# EAGLE schematic teensyMotors02_up_LED (EAGLE 9.1.3)

## Sheet 1 of 2
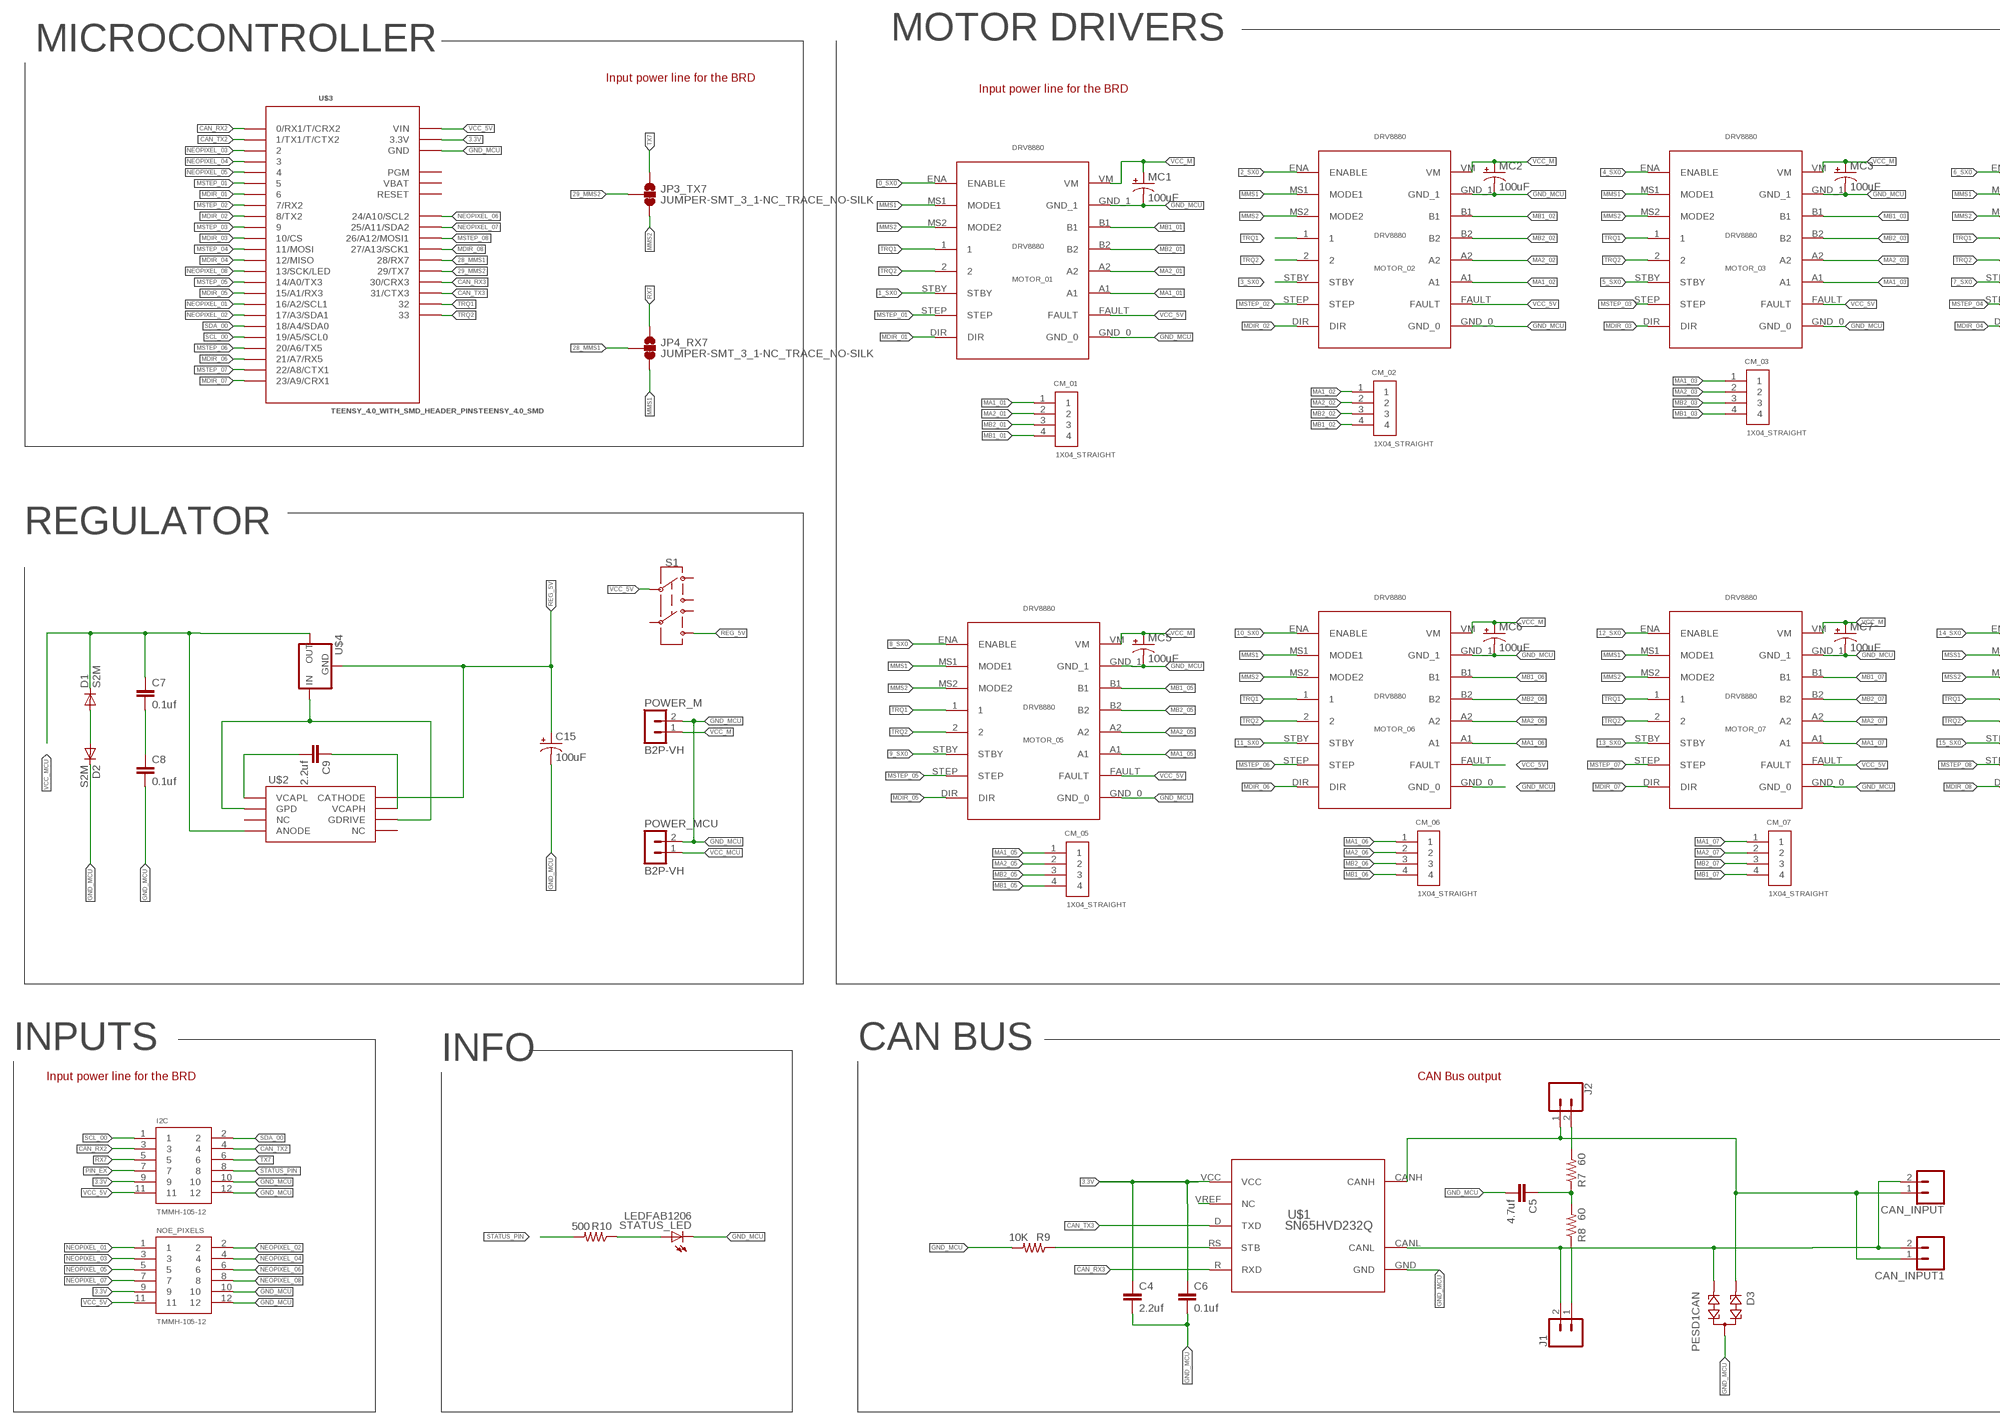
[diagram p0: schematic, sheet 1, part 1 of 2]
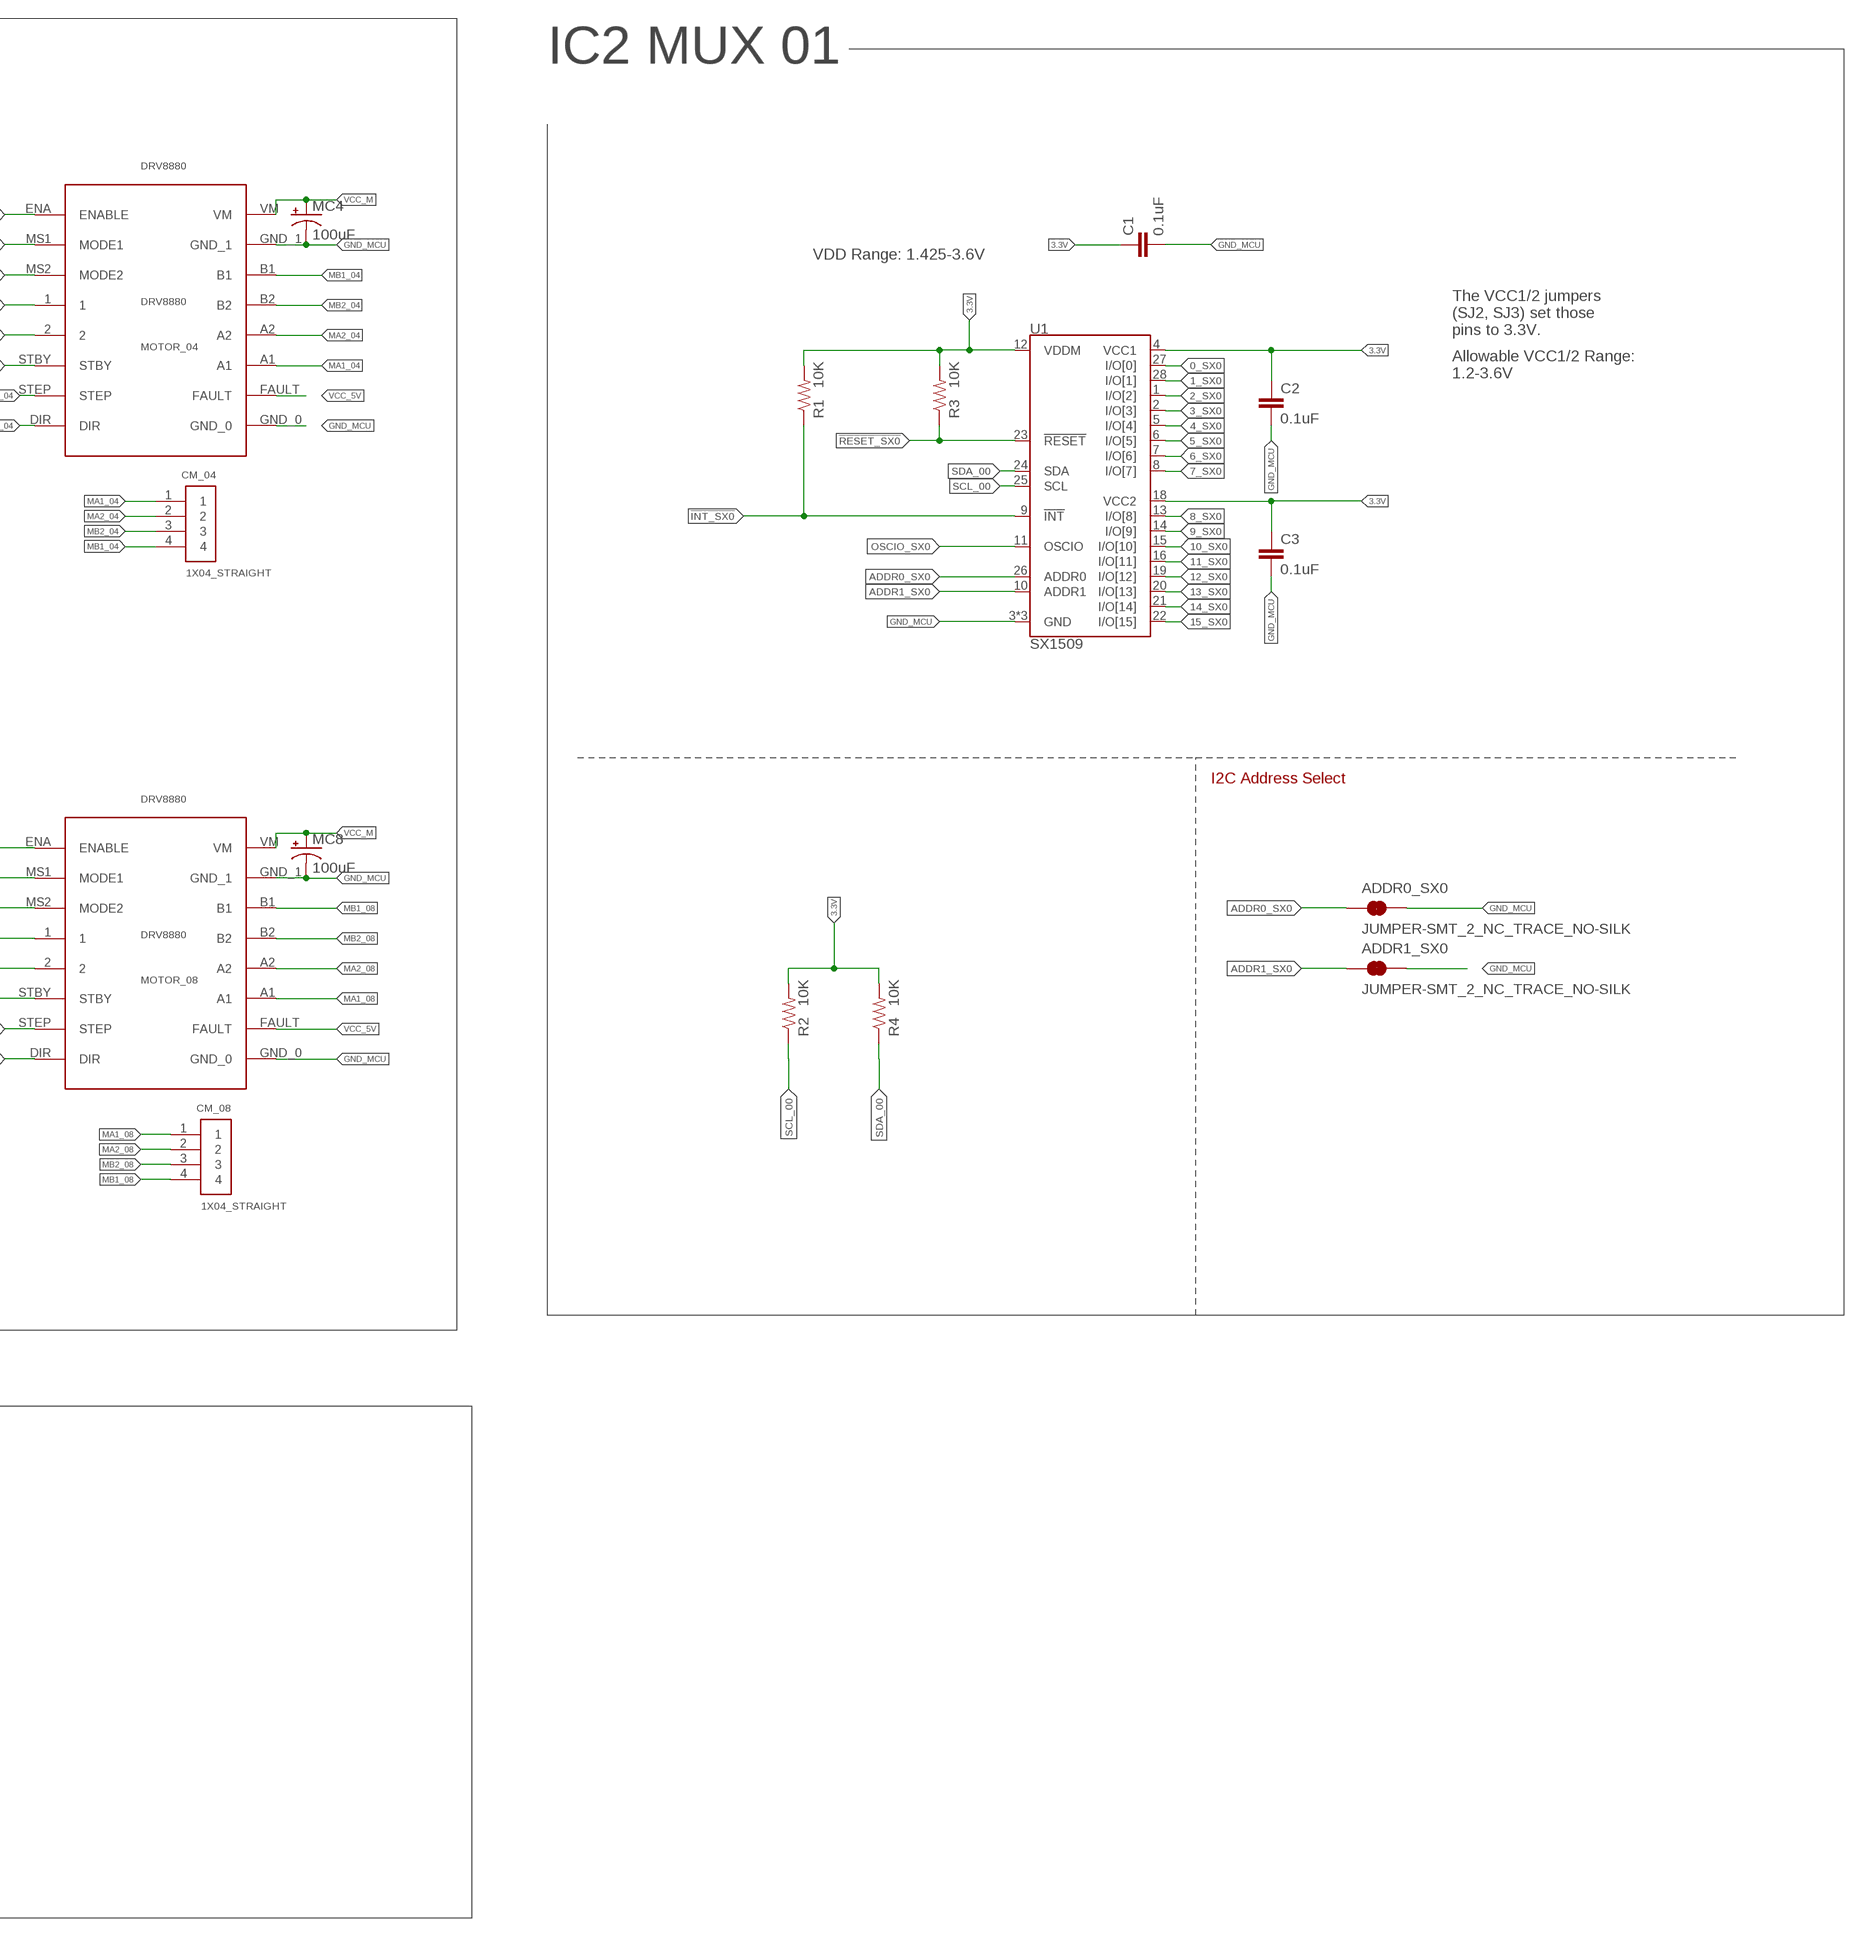
[diagram p1: schematic, sheet 1, part 2 of 2]

### Parts
ADDR0_SX0  JUMPER-SMT_2_NC_TRACE_NO-SILK  [SMT-JUMPER_2_NC_TRACE_NO-SILK]
ADDR1_SX0  JUMPER-SMT_2_NC_TRACE_NO-SILK  [SMT-JUMPER_2_NC_TRACE_NO-SILK]
C1  0.1uF  0.1UF-25V(+80/-20%)(0603)  [0603-CAP]
C2  0.1uF  0.1UF-25V(+80/-20%)(0603)  [0603-CAP]
C3  0.1uF  0.1UF-25V(+80/-20%)(0603)  [0603-CAP]
C4  2.2uf  0.1UF-25V(+80/-20%)(0603)  [0603-CAP]
C5  4.7uf  0.1UF-25V(+80/-20%)(0603)  [0603-CAP]
C6  0.1uf  0.1UF-25V(+80/-20%)(0603)  [0603-CAP]
C7  0.1uf  0.1UF-25V(+80/-20%)(0603)  [0603-CAP]
C8  0.1uf  0.1UF-25V(+80/-20%)(0603)  [0603-CAP]
C9  2.2uf  0.1UF-25V(+80/-20%)(0603)  [0603-CAP]
C15  100uF  100UF-POLAR-25V-20%(ELEC)  [PANASONIC_D]
CAN_INPUT  CONN_02-JST-2MM-SMT  [JST-2-SMD]
CAN_INPUT1  CONN_02-JST-2MM-SMT  [JST-2-SMD]
CM_01  1X04_STRAIGHT  1X4-CLEANBIG  [1X04-CLEANBIG]
CM_02  1X04_STRAIGHT  1X4-CLEANBIG  [1X04-CLEANBIG]
CM_03  1X04_STRAIGHT  1X4-CLEANBIG  [1X04-CLEANBIG]
CM_04  1X04_STRAIGHT  1X4-CLEANBIG  [1X04-CLEANBIG]
CM_05  1X04_STRAIGHT  1X4-CLEANBIG  [1X04-CLEANBIG]
CM_06  1X04_STRAIGHT  1X4-CLEANBIG  [1X04-CLEANBIG]
CM_07  1X04_STRAIGHT  1X4-CLEANBIG  [1X04-CLEANBIG]
CM_08  1X04_STRAIGHT  1X4-CLEANBIG  [1X04-CLEANBIG]
D1  S2M  [DO214AA]
D2  S2M  [DO214AA]
D3  PESD1CAN  [SOT23]
I2C  TMMH-105-12  [TMMH-105-12]
J1  CONN_02  [1X02]
J2  CONN_02  [1X02]
JP3_TX7  JUMPER-SMT_3_1-NC_TRACE_NO-SILK  [SMT-JUMPER_3_1-NC_TRACE_NO-SILK]
JP4_RX7  JUMPER-SMT_3_1-NC_TRACE_NO-SILK  [SMT-JUMPER_3_1-NC_TRACE_NO-SILK]
MC1  100uF  100UF-POLAR-25V-20%(ELEC)  [PANASONIC_D]
MC2  100uF  100UF-POLAR-25V-20%(ELEC)  [PANASONIC_D]
MC3  100uF  100UF-POLAR-25V-20%(ELEC)  [PANASONIC_D]
MC4  100uF  100UF-POLAR-25V-20%(ELEC)  [PANASONIC_D]
MC5  100uF  100UF-POLAR-25V-20%(ELEC)  [PANASONIC_D]
MC6  100uF  100UF-POLAR-25V-20%(ELEC)  [PANASONIC_D]
MC7  100uF  100UF-POLAR-25V-20%(ELEC)  [PANASONIC_D]
MC8  100uF  100UF-POLAR-25V-20%(ELEC)  [PANASONIC_D]
MOTOR_01  DRV8880  [DRV8880]
MOTOR_02  DRV8880  [DRV8880]
MOTOR_03  DRV8880  [DRV8880]
MOTOR_04  DRV8880  [DRV8880]
MOTOR_05  DRV8880  [DRV8880]
MOTOR_06  DRV8880  [DRV8880]
MOTOR_07  DRV8880  [DRV8880]
MOTOR_08  DRV8880  [DRV8880]
NOE_PIXELS  TMMH-105-12  [TMMH-105-12]
POWER_M  B2P-VH  [B2P-VH]
POWER_MCU  B2P-VH  [B2P-VH]
R1  10K  10KOHM-1/10W-1%(0603)0603  [0603-RES]
R2  10K  10KOHM-1/10W-1%(0603)0603  [0603-RES]
R3  10K  10KOHM-1/10W-1%(0603)0603  [0603-RES]
R4  10K  10KOHM-1/10W-1%(0603)0603  [0603-RES]
R7  60  10KOHM-1/10W-1%(0603)0603  [0603-RES]
R8  60  10KOHM-1/10W-1%(0603)0603  [0603-RES]
R9  10K  10KOHM-1/10W-1%(0603)0603  [0603-RES]
R10  500  10KOHM-1/10W-1%(0603)0603  [0603-RES]
S1  SWITCH-DPDT-SMD-AYZ0202  [SWITCH_DPDT_SMD_AYZ0202]
STATUS_LED  LEDFAB1206  [LED1206FAB]
U1  SX1509  [QFN-28]
U$1  SN65HVD232Q  [SN65HVD232Q]
U$2  LM74610-Q1  [VSSOP(8)]
U$3  TEENSY_4.0_WITH_SMD_HEADER_PINSTEENSY_4.0_SMD  [TEENSY_4.0_SMD]
U$4  BUK  [TO263-3]

### Nets
0_SX0: MOTOR_01.ENA(ENABLE) U1.27(I/O[0])
1_SX0: MOTOR_01.STBY U1.28(I/O[1])
2_SX0: MOTOR_02.ENA(ENABLE) U1.1(I/O[2])
3.3V [vcc]: C1.1 C2.1 C3.1 C4.1 C6.1 I2C.9 NOE_PIXELS.9 R1.2 R2.2 R3.2 R4.2 U1.4(VCC1) U1.12(VDDM) U1.18(VCC2) U$1.VCC U$3.3.3V U$3.3.3V1(3.3V)
3_SX0: MOTOR_02.STBY U1.2(I/O[3])
4_SX0: MOTOR_03.ENA(ENABLE) U1.5(I/O[4])
5_SX0: MOTOR_03.STBY U1.6(I/O[5])
6_SX0: MOTOR_04.ENA(ENABLE) U1.7(I/O[6])
7_SX0: MOTOR_04.STBY U1.8(I/O[7])
8_SX0: MOTOR_05.ENA(ENABLE) U1.13(I/O[8])
9_SX0: MOTOR_05.STBY U1.14(I/O[9])
10_SX0: MOTOR_06.ENA(ENABLE) U1.15(I/O[10])
11_SX0: MOTOR_06.STBY U1.16(I/O[11])
12_SX0: MOTOR_07.ENA(ENABLE) U1.19(I/O[12])
13_SX0: MOTOR_07.STBY U1.20(I/O[13])
14_SX0: MOTOR_08.ENA(ENABLE) U1.21(I/O[14])
15_SX0: MOTOR_08.STBY U1.22(I/O[15])
28_MMS1: JP4_RX7.2 U$3.28(28/RX7)
29_MMS2: JP3_TX7.2 U$3.29(29/TX7)
!INT_SX0: R1.1 U1.9(!INT)
!RESET_SX0: R3.1 U1.23(!RESET)
ADDR0_SX0: ADDR0_SX0.1 U1.26(ADDR0)
ADDR1_SX0: ADDR1_SX0.1 U1.10(ADDR1)
CAN_H: CAN_INPUT1.1 CAN_INPUT.1 D3.1 J2.1 U$1.CANH
CAN_L: CAN_INPUT1.2 CAN_INPUT.2 D3.2 J1.2 U$1.CANL
CAN_RX2: I2C.3 U$3.0(0/RX1/T/CRX2)
CAN_RX3: U$1.R(RXD) U$3.30(30/CRX3)
CAN_TX2: I2C.4 U$3.1(1/TX1/T/CTX2)
CAN_TX3: U$1.D(TXD) U$3.31(31/CTX3)
GND_MCU [gnd]: ADDR0_SX0.2 ADDR1_SX0.2 C1.2 C2.2 C3.2 C4.2 C5.2 C6.2 C8.2 C15.- D2.C D3.3 I2C.10 I2C.12 MC1.- MC2.- MC3.- MC4.- MC5.- MC6.- MC7.- MC8.- MOTOR_01.GND_0 MOTOR_01.GND_1 MOTOR_02.GND_0 MOTOR_02.GND_1 MOTOR_03.GND_0 MOTOR_03.GND_1 MOTOR_04.GND_0 MOTOR_04.GND_1 MOTOR_05.GND_0 MOTOR_05.GND_1 MOTOR_06.GND_0 MOTOR_06.GND_1 MOTOR_07.GND_0 MOTOR_07.GND_1 MOTOR_08.GND_0 MOTOR_08.GND_1 NOE_PIXELS.10 NOE_PIXELS.12 POWER_M.2 POWER_MCU.2 R9.2 STATUS_LED.2(C) U1.3(GND) U1.17(GND) U1.29(GND) U$1.GND U$3.GND U$3.GND1(GND) U$3.GND2(GND)
MA1_01 [vcc]: CM_01.1 MOTOR_01.A1
MA1_02 [vcc]: CM_02.1 MOTOR_02.A1
MA1_03 [vcc]: CM_03.1 MOTOR_03.A1
MA1_04 [vcc]: CM_04.1 MOTOR_04.A1
MA1_05 [vcc]: CM_05.1 MOTOR_05.A1
MA1_06 [vcc]: CM_06.1 MOTOR_06.A1
MA1_07 [vcc]: CM_07.1 MOTOR_07.A1
MA1_08 [vcc]: CM_08.1 MOTOR_08.A1
MA2_01 [vcc]: CM_01.2 MOTOR_01.A2
MA2_02 [vcc]: CM_02.2 MOTOR_02.A2
MA2_03 [vcc]: CM_03.2 MOTOR_03.A2
MA2_04 [vcc]: CM_04.2 MOTOR_04.A2
MA2_05 [vcc]: CM_05.2 MOTOR_05.A2
MA2_06 [vcc]: CM_06.2 MOTOR_06.A2
MA2_07 [vcc]: CM_07.2 MOTOR_07.A2
MA2_08 [vcc]: CM_08.2 MOTOR_08.A2
MB1_01 [vcc]: CM_01.4 MOTOR_01.B1
MB1_02 [vcc]: CM_02.4 MOTOR_02.B1
MB1_03 [vcc]: CM_03.4 MOTOR_03.B1
MB1_04 [vcc]: CM_04.4 MOTOR_04.B1
MB1_05 [vcc]: CM_05.4 MOTOR_05.B1
MB1_06 [vcc]: CM_06.4 MOTOR_06.B1
MB1_07 [vcc]: CM_07.4 MOTOR_07.B1
MB1_08 [vcc]: CM_08.4 MOTOR_08.B1
MB2_01 [vcc]: CM_01.3 MOTOR_01.B2
MB2_02 [vcc]: CM_02.3 MOTOR_02.B2
MB2_03 [vcc]: CM_03.3 MOTOR_03.B2
MB2_04 [vcc]: CM_04.3 MOTOR_04.B2
MB2_05 [vcc]: CM_05.3 MOTOR_05.B2
MB2_06 [vcc]: CM_06.3 MOTOR_06.B2
MB2_07 [vcc]: CM_07.3 MOTOR_07.B2
MB2_08 [vcc]: CM_08.3 MOTOR_08.B2
MDIR_01: MOTOR_01.DIR U$3.6
MDIR_02: MOTOR_02.DIR U$3.8(8/TX2)
MDIR_03: MOTOR_03.DIR U$3.10(10/CS)
MDIR_04: MOTOR_04.DIR U$3.12(12/MISO)
MDIR_05: MOTOR_05.DIR U$3.15/A1(15/A1/RX3)
MDIR_06: MOTOR_06.DIR U$3.21/A7(21/A7/RX5)
MDIR_07: MOTOR_07.DIR U$3.23/A9(23/A9/CRX1)
MDIR_08: MOTOR_08.DIR U$3.27(27/A13/SCK1)
MMS1: JP4_RX7.3 MOTOR_01.MS1(MODE1) MOTOR_02.MS1(MODE1) MOTOR_03.MS1(MODE1) MOTOR_04.MS1(MODE1) MOTOR_05.MS1(MODE1) MOTOR_06.MS1(MODE1) MOTOR_07.MS1(MODE1)
MMS2: JP3_TX7.3 MOTOR_01.MS2(MODE2) MOTOR_02.MS2(MODE2) MOTOR_03.MS2(MODE2) MOTOR_04.MS2(MODE2) MOTOR_05.MS2(MODE2) MOTOR_06.MS2(MODE2) MOTOR_07.MS2(MODE2)
MSS1: MOTOR_08.MS1(MODE1)
MSS2: MOTOR_08.MS2(MODE2)
MSTEP_01: MOTOR_01.STEP U$3.5
MSTEP_02: MOTOR_02.STEP U$3.7(7/RX2)
MSTEP_03: MOTOR_03.STEP U$3.9
MSTEP_04: MOTOR_04.STEP U$3.11(11/MOSI)
MSTEP_05: MOTOR_05.STEP U$3.14/A0(14/A0/TX3)
MSTEP_06: MOTOR_06.STEP U$3.20/A6(20/A6/TX5)
MSTEP_07: MOTOR_07.STEP U$3.22/A8(22/A8/CTX1)
MSTEP_08: MOTOR_08.STEP U$3.26(26/A12/MOSI1)
N$1: J2.2 R7.2
N$2: C9.1 U$2.VCAPH
N$3: U$1.VREF(NC)
N$4: U$2.GDRIVE U$2.GPD U$4.1(IN)
N$5: C9.2 U$2.VCAPL
N$6: R9.1 U$1.RS(STB)
N$9: C7.2 C8.1
N$12: D1.A D2.A
N$13: C5.1 R7.1 R8.2
N$14: J1.1 R8.1
N$193: R10.1 STATUS_LED.1(A)
NEOPIXEL_01: NOE_PIXELS.1 U$3.16/A2(16/A2/SCL1)
NEOPIXEL_02: NOE_PIXELS.2 U$3.17/A3(17/A3/SDA1)
NEOPIXEL_03: NOE_PIXELS.3 U$3.2
NEOPIXEL_04: NOE_PIXELS.4 U$3.3
NEOPIXEL_05: NOE_PIXELS.5 U$3.4
NEOPIXEL_06: NOE_PIXELS.6 U$3.24(24/A10/SCL2)
NEOPIXEL_07: NOE_PIXELS.7 U$3.25(25/A11/SDA2)
NEOPIXEL_08: NOE_PIXELS.8 U$3.13(13/SCK/LED)
OSCIO_SX0: U1.11(OSCIO)
PIN_EX: I2C.7
REG_5V [vcc5]: C15.+ S1.6 U$2.CATHODE U$4.4(GND)
RX7: I2C.5 JP4_RX7.1
SCL_00: I2C.1 R2.1 U1.25(SCL) U$3.19/A5(19/A5/SCL0)
SDA_00: I2C.2 R4.1 U1.24(SDA) U$3.18/A4(18/A4/SDA0)
STATUS_PIN: I2C.8 R10.2
TRQ1: MOTOR_01.1 MOTOR_02.1 MOTOR_03.1 MOTOR_04.1 MOTOR_05.1 MOTOR_06.1 MOTOR_07.1 MOTOR_08.1 U$3.32
TRQ2: MOTOR_01.2 MOTOR_02.2 MOTOR_03.2 MOTOR_04.2 MOTOR_05.2 MOTOR_06.2 MOTOR_07.2 MOTOR_08.2 U$3.33
TX7: I2C.6 JP3_TX7.1
VCC_5V [vcc5]: I2C.11 MOTOR_01.FAULT MOTOR_02.FAULT MOTOR_03.FAULT MOTOR_04.FAULT MOTOR_05.FAULT MOTOR_06.FAULT MOTOR_07.FAULT MOTOR_08.FAULT NOE_PIXELS.11 S1.2 U$3.VIN
VCC_M [vcc]: MC1.+ MC2.+ MC3.+ MC4.+ MC5.+ MC6.+ MC7.+ MC8.+ MOTOR_01.VM MOTOR_02.VM MOTOR_03.VM MOTOR_04.VM MOTOR_05.VM MOTOR_06.VM MOTOR_07.VM MOTOR_08.VM POWER_M.1
VCC_MCU [vcc]: C7.1 D1.C POWER_MCU.1 U$2.ANODE U$4.3(OUT)
Unconnected: S1.1 S1.3 S1.4 S1.5 U$2.NC@1(NC) U$2.NC@2(NC) U$3.PGM U$3.RESET

### Notes on the sheet
- MICROCONTROLLER | MOTOR DRIVERS
- IC2 MUX 01
- Input power line for the BRD
- Input power line for the BRD
- VDD Range: 1.425-3.6V
- The VCC1/2 jumpers 
  (SJ2, SJ3) set those 
  pins to 3.3V.
- Allowable VCC1/2 Range: 
  1.2-3.6V
- REGULATOR
- I2C Address Select
- INPUTS | INFO | CAN BUS
- Input power line for the BRD | CAN Bus output

## Sheet 2 of 2

## Power pins joined to a net without a drawn wire
VBAT: U$3.VBAT

## Library data of the parts
ADDR0_SX0 ADDR1_SX0 = SparkFun-Jumpers:JUMPER-SMT_2_NC_TRACE: Normally closed trace jumper This jumper has a trace between two pads so it's normally closed (NC). Use a razor knife to open the connection. For best results follow the IPC guidelines for cutting traces: Cutout at least 0.063 mm (0.005 in). Remove all loose material to clean up the cut area. Seal the cut with an approved epoxy. Reapply solder to reclose the connection.
C1-C3 = SparkFun-Capacitors:0.1UF-25V(+80/-20%)(0603): CAP-00810 Ceramic Standard decoupling cap; PROD_ID: CAP-00810
C4-C9 = SparkFun-Capacitors:0.1UF-25V(+80/-20%)(0603): CAP-00810 Ceramic Standard decoupling cap; PROD_ID: CAP-00810; VALUE: 0.1uF
C15 MC1-MC8 = SparkFun-Capacitors:100UF-POLAR: 100µF polarized capacitors A capacitor is a passive two-terminal electrical component used to store electrical energy temporarily in an electric field.; PROD_ID: CAP-12547
CAN_INPUT CAN_INPUT1 = SparkFun-Connectors:CONN_02: Multi connection point. Often used as Generic Header-pin footprint for 0.1 inch spaced/style header connections On any of the 0.1 inch spaced packages, you can populate with these: Break Away Headers - Straight <https://www.sparkfun.com/products/116> (PRT-00116) Break Away Male Headers - Right Angle <https://www.sparkfun.com/products/553> (PRT-00553) Female Headers <https://www.sparkfun.com/products/115> (PRT-00115) Break Away Headers - Machine Pin <https://www.sparkfun.com/products/117> (PRT-00117) Break Away Female Headers - Swiss Machine Pin <https://www.sparkfun.com/products/743> (PRT-00743) For SCREWTERMINALS and SPRING TERMINALS visit here: Screw Terimnals on SparkFun.com <https://www.sparkfun.com/search/results?term=Screw+Terminals> (5mm/3.5mm/2.54mm spacing) This device is also useful as a general connection point to wire up your design to another part of your project. Our various solder wires solder well into these plated through hole pads. Hook-Up Wire - Assortment (Stranded, 22 AWG) <https://www.sparkfun.com/products/11375> (PRT-11375) Hook-Up Wire - Assortment (Solid Core, 22 AWG) <https://www.sparkfun.com/products/11367> (PRT-11367) View the entire wire category on our website here <https://www.sparkfun.com/categories/141> Special notes: Molex polarized connector foot print use with: PRT-08233 with associated crimp pins and housings. 2.54_SCREWTERM for use with PRT-10571. 3.5mm Screw Terminal footprints for PRT-08084 5mm Screw Terminal footprints for use with PRT-08432; PROD_ID: CONN-11443
CM_01-CM_08 = adafruit:1X4: 4-pin connector
D1 D2 = s2x_10:S2*: S2A - S2M General Purpose Rectifiers Source: http://www.fairchildsemi.com/datasheets/S2/S2A.pdf; MF: Fairchild; MPN: S2M; OC_FARNELL: 9843876; OC_NEWARK: 58K9553
D3 = diode:PESD1CAN: CAN bus ESD protection diode Source: http://www.nxp.com/documents/data_sheet/PESD1CAN.pdf
I2C NOE_PIXELS = TMMH-105-XX-XX-DV:TMMH-105-12: 2mm (.0787") Flex Shroud, .020" (.51mm) Square Post Terminal Strip, Surface Mount,10 Pins.
J1 J2 = SparkFun-Connectors:CONN_02: Multi connection point. Often used as Generic Header-pin footprint for 0.1 inch spaced/style header connections On any of the 0.1 inch spaced packages, you can populate with these: Break Away Headers - Straight <https://www.sparkfun.com/products/116> (PRT-00116) Break Away Male Headers - Right Angle <https://www.sparkfun.com/products/553> (PRT-00553) Female Headers <https://www.sparkfun.com/products/115> (PRT-00115) Break Away Headers - Machine Pin <https://www.sparkfun.com/products/117> (PRT-00117) Break Away Female Headers - Swiss Machine Pin <https://www.sparkfun.com/products/743> (PRT-00743) For SCREWTERMINALS and SPRING TERMINALS visit here: Screw Terimnals on SparkFun.com <https://www.sparkfun.com/search/results?term=Screw+Terminals> (5mm/3.5mm/2.54mm spacing) This device is also useful as a general connection point to wire up your design to another part of your project. Our various solder wires solder well into these plated through hole pads. Hook-Up Wire - Assortment (Stranded, 22 AWG) <https://www.sparkfun.com/products/11375> (PRT-11375) Hook-Up Wire - Assortment (Solid Core, 22 AWG) <https://www.sparkfun.com/products/11367> (PRT-11367) View the entire wire category on our website here <https://www.sparkfun.com/categories/141> Special notes: Molex polarized connector foot print use with: PRT-08233 with associated crimp pins and housings. 2.54_SCREWTERM for use with PRT-10571. 3.5mm Screw Terminal footprints for PRT-08084 5mm Screw Terminal footprints for use with PRT-08432
JP3_TX7 JP4_RX7 = SparkFun-Jumpers:JUMPER-SMT_3_1-NC_TRACE: Normally closed trace jumper (1 of 2 connections) This jumper has a trace between two pads so it's normally closed (NC). The other connection is normally open (NO). Use a razor knife to open the connection. For best results follow the IPC guidelines for cutting traces: Cutout at least 0.063 mm (0.005 in). Remove all loose material to clean up the cut area. Seal the cut with an approved epoxy. Reapply solder to reclose the connection, or to close the NO connection.
MOTOR_01-MOTOR_08 = STSPIN220:DRV8880
POWER_M POWER_MCU = con-JST VH:B2P-VH: JST VH Series header 3.96mm pitch disconnectable crimp style connectors, vertical (side entry type), 2 pins
R1-R4 R9 = SparkFun-Resistors:10KOHM-1/10W-1%(0603): RES-00824; PROD_ID: RES-00824
R7 R8 R10 = SparkFun-Resistors:10KOHM-1/10W-1%(0603): RES-00824; PROD_ID: RES-00824; VALUE: 10K
S1 = SparkFun-Switches:SWITCH-DPDT: Double-Pole, Double-Throw (DPDT) Switch Double-pole, double-throw switches. Variant Overview PTH-GPI-152-3013 Used on SparkFun Geiger Counter <https://www.sparkfun.com/products/11345> SMD-AY0202 Surface Mount DPDT Switch <https://www.sparkfun.com/products/597> (COM-00597) Used on e.g. LilyPad Arduino USB - ATmega32U4 Board <https://www.sparkfun.com/products/12049>; PROD_ID: SWCH-08179; SF_SKU: COM-00597; SPICEPREFIX: X
STATUS_LED = fab:LED: LED
U1 = SparkFun-DigitalIC:SX1509: Semtech SX1509 The SX1509 is a complete ultra low voltage 1.2V to 3.6V General Purpose parallel Input/Output (GPIO) expanders ideal for low power handheld battery powered equipment. This version comes in a 16-channel configuration and allows easy serial expansion of I/O through a standard 400kHz I2C interface. GPIO devices can provide additional control and monitoring when the microcontroller or chipset has insufficient I/O ports, or in systems where serial communication and control from a remote location is advantageous.
U$1 = TCAN1042DRQ1:SN65HVD232Q
U$2 = 1zac:LM74610-Q1: LM74610-Q1 Zero IQ Reverse Polarity Protection Smart Diode Controller; MPN: LM74610-Q1
U$3 = Teensy4:TEENSY_4.0_WITH_SMD_HEADER_PINS: Footprint for Teensy 3.1 or 3.2 board using all pin connections on the outer perimeter
U$4 = v-reg-2:BUK

## Net classes
0 default: width 0.2 mm, clearance 0.2 mm
1 gnd: width 0.2 mm, clearance 0.2 mm
3 vcc: width 0.2 mm, clearance 0.2 mm
4 vcc5: width 0.35 mm, clearance 0.2 mm